# EAGLE board Analog CAN Module (EAGLE 8.3.2), part 1 of 2
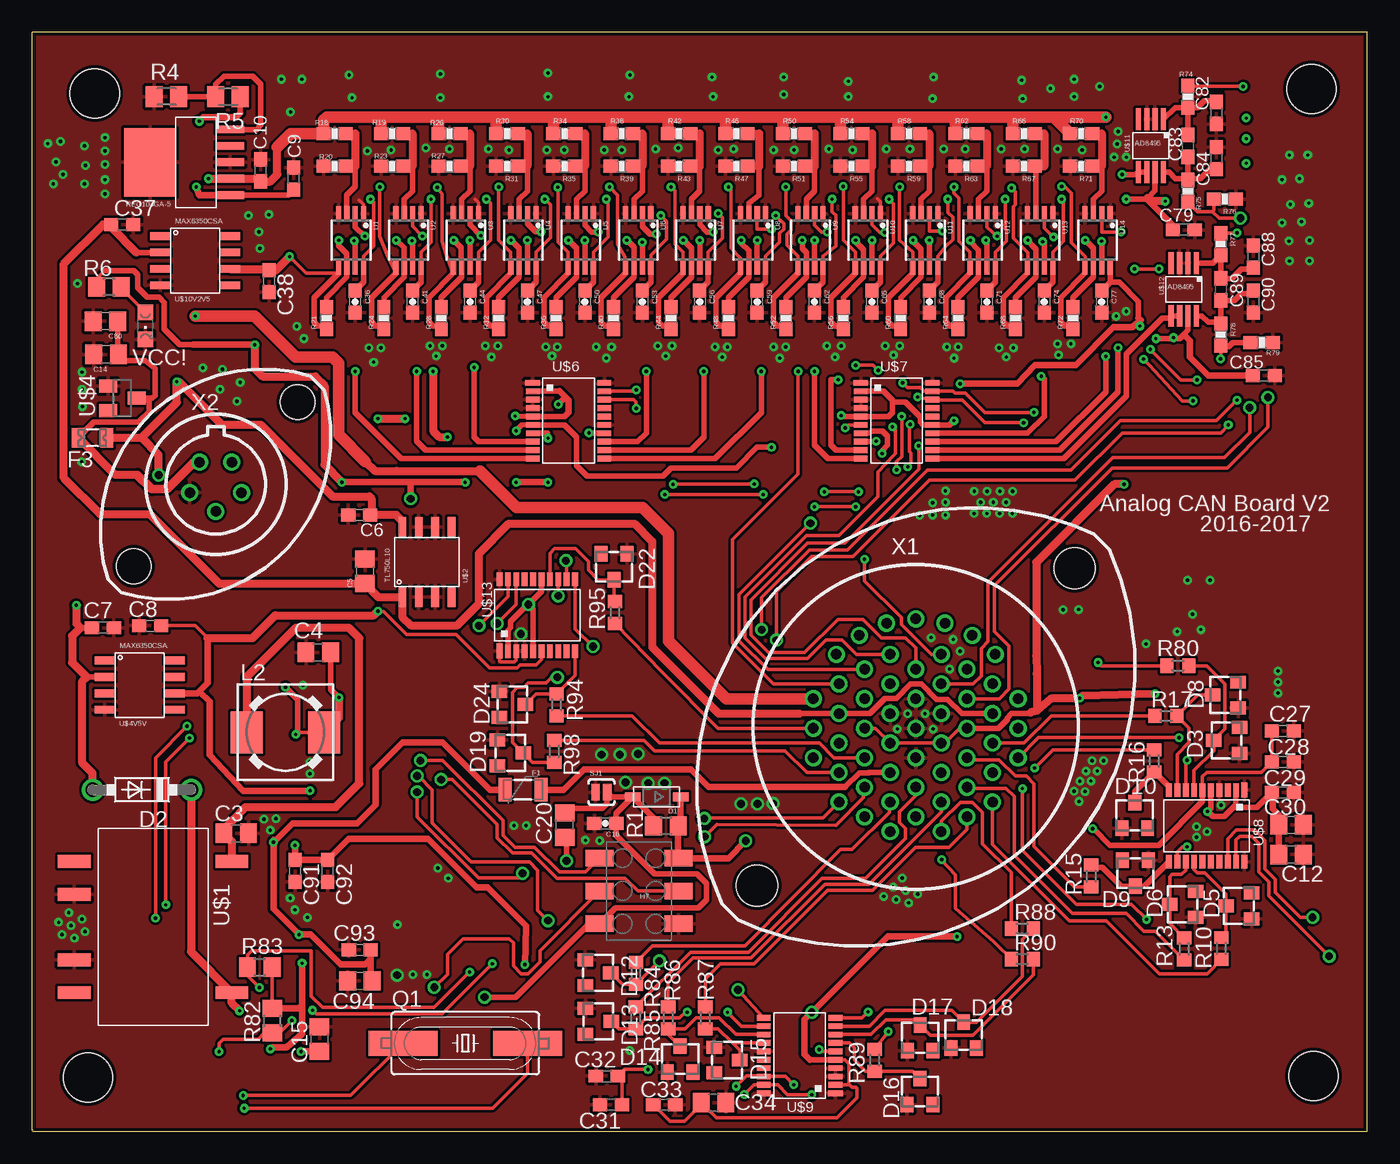
[diagram p3: board, top side]
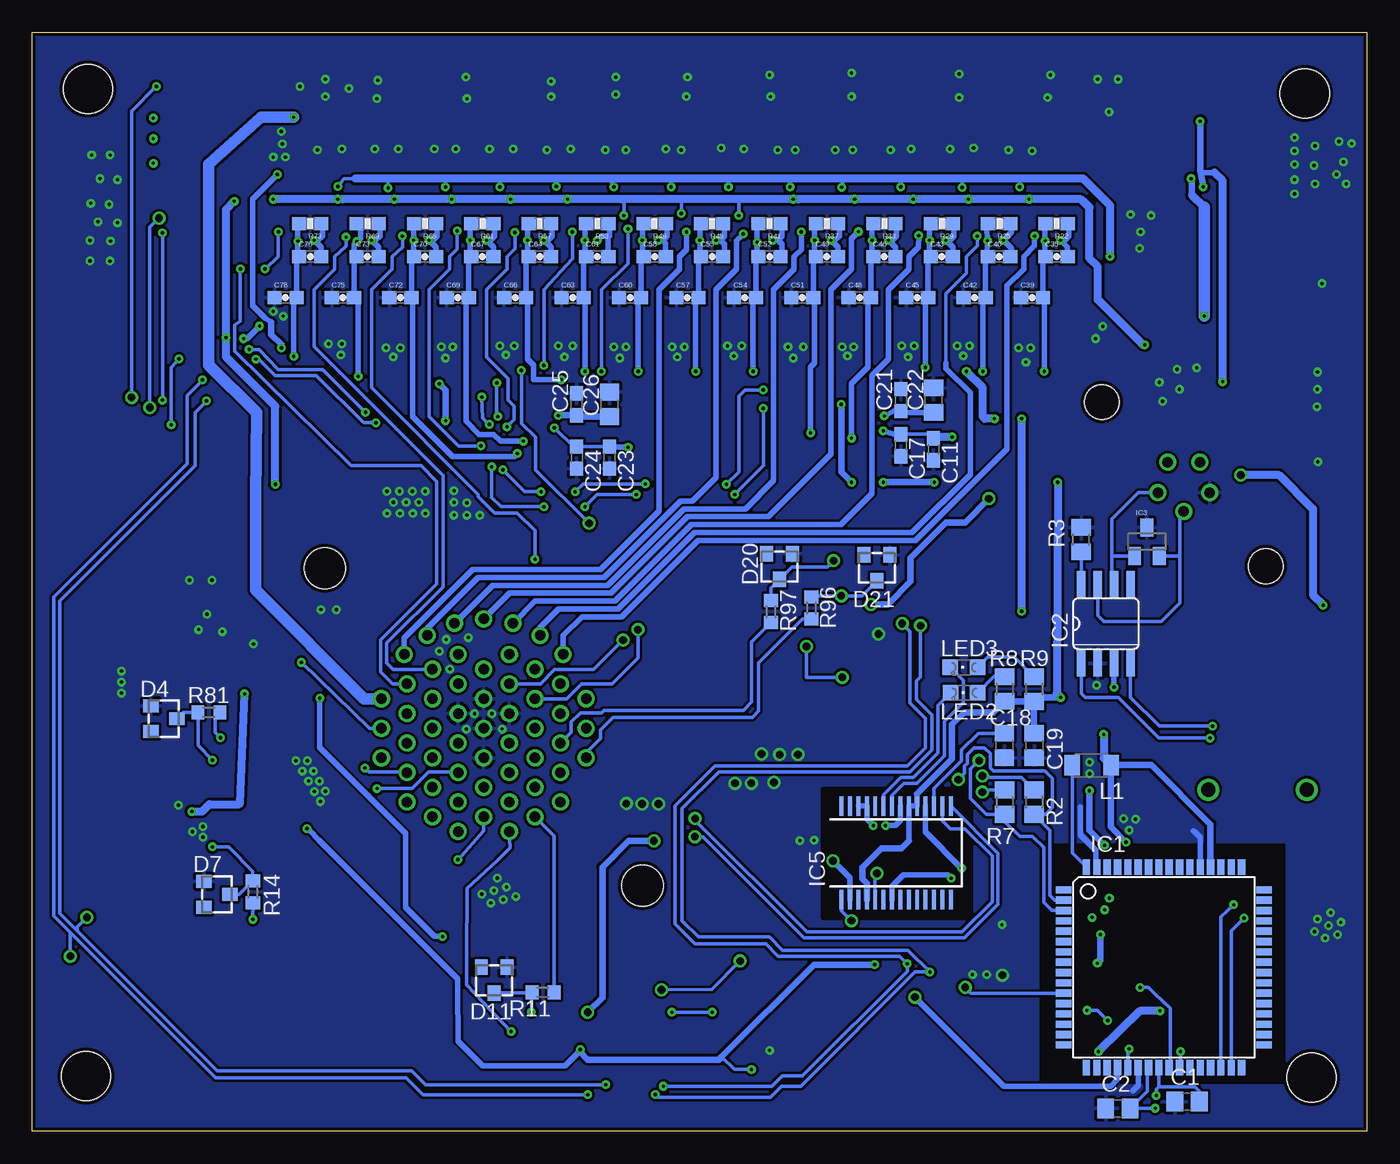
[diagram p4: board, bottom side, seen from below]

Size 103.33 x 85.08 mm. Coordinates in mm from the lower left corner, seen from the top.
Outline: 0,0 103.33,0 103.33,85.08 0,85.08 0,0.08 0.08,0.08
Copper layers (1*16): Top 0.035mm / dielectric 1.5mm / Bottom 0.035mm
Design rules "default *": minimum track width 8mil, minimum drill 10mil, track to track 8mil, track to pad 8mil, pad to pad 8mil, via to via 8mil, smd to smd 8mil, copper to edge 11mil, drill to drill 11mil, minimum pad ring 10mil, minimum via ring 8mil, stop-mask expansion 4mil, vias tented up to drill 0mil, thermal gap 10mil
Holes 3.81 mm at 99.02,80.69 4.83,80.34 4.3,4.15 99.18,4.27

## Footprints (pad centres in the part's own frame; a part is rotated, then mirrored left to right if it is on the bottom)
C0805@1 = smd 1.3 x 1.5: 1 -0.95,0; 2 0.95,0
C0805 = smd 1.3 x 1.5: 1 -0.95,0; 2 0.95,0
C0603 = smd 1.1 x 1: 1 -0.85,0; 2 0.85,0
C0603@1 = smd 1.1 x 1: 1 -0.85,0; 2 0.85,0
0603-CAP = smd 1.1 x 1: 1 -0.85,0; 2 0.85,0
SOD-123 = smd 1.2 x 0.7: A 1.85,0; C -1.85,0
DO41-7.6 = drill 1.1 pad 1.7: A 3.81,0; C -3.81,0
TO236 = smd 1 x 1.2: A -1,-1; C 0,1; NC 1,-1
PTC-1206 = smd 1 x 1.8: 1 -1.4,0; 2 1.4,0
0805L = smd 1 x 1.5: 1 -1.1,0; 2 1.1,0
2X3_SMD_FCI_54202-G30 = smd 1.27 x 2.18: 1 -2.54,-3.05; 2 -2.54,3.05; 3 0,-3.05; 4 0,3.05; 5 2.54,-3.05; 6 2.54,3.05
TQFP64 = smd 1.194 x 0.559: 1 -7.76,6; 2 -7.76,5.2; 3 -7.76,4.4; 4 -7.76,3.6; 5 -7.76,2.8; 6 -7.76,2; 7 -7.76,1.2; 8 -7.76,0.4; 9 -7.76,-0.4; 10 -7.76,-1.2; 11 -7.76,-2; 12 -7.76,-2.8; 13 -7.76,-3.6; 14 -7.76,-4.4; 15 -7.76,-5.2; 16 -7.76,-6; 33 7.76,-6; 34 7.76,-5.2; 35 7.76,-4.4; 36 7.76,-3.6; 37 7.76,-2.8; 38 7.76,-2; 39 7.76,-1.2; 40 7.76,-0.4; 41 7.76,0.4; 42 7.76,1.2; 43 7.76,2; 44 7.76,2.8; 45 7.76,3.6; 46 7.76,4.4; 47 7.76,5.2; 48 7.76,6 | smd 0.559 x 1.194: 17 -6,-7.76; 18 -5.2,-7.76; 19 -4.4,-7.76; 20 -3.6,-7.76; 21 -2.8,-7.76; 22 -2,-7.76; 23 -1.2,-7.76; 24 -0.4,-7.76; 25 0.4,-7.76; 26 1.2,-7.76; 27 2,-7.76; 28 2.8,-7.76; 29 3.6,-7.76; 30 4.4,-7.76; 31 5.2,-7.76; 32 6,-7.76; 49 6,7.76; 50 5.2,7.76; 51 4.4,7.76; 52 3.6,7.76; 53 2.8,7.76; 54 2,7.76; 55 1.2,7.76; 56 0.4,7.76; 57 -0.4,7.76; 58 -1.2,7.76; 59 -2,7.76; 60 -2.8,7.76; 61 -3.6,7.76; 62 -4.4,7.76; 63 -5.2,7.76; 64 -6,7.76
SO08 = smd 0.66 x 2.032: 1 -1.905,-3.073; 2 -0.635,-3.073; 3 0.635,-3.073; 4 1.905,-3.073; 5 1.905,3.073; 6 0.635,3.073; 7 -0.635,3.073; 8 -1.905,3.073
SOT-23 = smd 1 x 1.4: 1 -0.95,-1.1; 2 0.95,-1.1; 3 0,1.1
SSOP28 = smd 0.381 x 1.499: 1 -4.225,-3.625; 2 -3.575,-3.625; 3 -2.925,-3.625; 4 -2.275,-3.625; 5 -1.625,-3.625; 6 -0.975,-3.625; 7 -0.325,-3.625; 8 0.325,-3.625; 9 0.975,-3.625; 10 1.625,-3.625; 11 2.275,-3.625; 12 2.925,-3.625; 13 3.575,-3.625; 14 4.225,-3.625; 15 4.225,3.625; 16 3.575,3.625; 17 2.925,3.625; 18 2.275,3.625; 19 1.625,3.625; 20 0.975,3.625; 21 0.325,3.625; 22 -0.325,3.625; 23 -0.975,3.625; 24 -1.625,3.625; 25 -2.275,3.625; 26 -2.925,3.625; 27 -3.575,3.625; 28 -4.225,3.625
L3216C = smd 1.2 x 1.6: 1 -1.5,0; 2 1.5,0
DR73 = smd 2.5 x 3.25: 1 -3,0; 2 3,0
CHIPLED_0805 = smd 1.2 x 1.2: A 0,-1.05; C 0,1.05
HC49UP = smd 5.334 x 1.93: 1 -4.826,0; 2 4.826,0
R0805 = smd 1.3 x 1.5: 1 -0.95,0; 2 0.95,0
M0805 = smd 1.3 x 1.6: 1 -0.95,0; 2 0.95,0
R0603 = smd 1 x 1.1: 1 -0.85,0; 2 0.85,0
0603-RES = smd 1.1 x 1: 1 -0.85,0; 2 0.85,0
SJ_2S-NO = smd 0.635 x 1.27: 1 -0.45,0; 2 0.45,0
MSOP8 = smd 0.4 x 1.2: 1 -0.975,-2.05; 2 -0.325,-2.05; 3 0.325,-2.05; 4 0.975,-2.05; 5 0.975,2.05; 6 0.325,2.05; 7 -0.325,2.05; 8 -0.975,2.05
V78XX-1000 = smd 1 x 2.54: 1 -5.08,-6.096; 5 5.08,-6.096; 6 5.08,6.096; 7 2.54,6.096; 9 -2.54,6.096; 10 -5.08,6.096
8-SOIC = smd 0.6 x 1.55: P1 -1.905,-2.7; P2 -0.635,-2.7; P3 0.635,-2.7; P4 1.905,-2.7; P5 1.905,2.7; P6 0.635,2.7; P7 -0.635,2.7; P8 -1.905,2.7
SOT23-3 = smd 1 x 1.4: 1 -0.95,-1.1; 2 0.95,-1.1; 3 0,1.1
REG104GA-5 = smd 0.6 x 2.2: ENABLE 2.54,-6.2; GND 0,-6.2; NR/ADJUST 1.27,-6.2; VIN -2.54,-6.2; VOUT -1.27,-6.2 | smd 5.3 x 4: HEATGND 0,0
20TSSOP = smd 0.45 x 1.15: 1 -2.925,-2.775 | smd 0.45 x 1.05: 2 -2.275,-2.775; 3 -1.625,-2.775; 4 -0.975,-2.775; 5 -0.325,-2.775; 6 0.325,-2.775; 7 0.975,-2.775; 8 1.625,-2.775; 9 2.275,-2.775; 10 2.925,-2.775; 11 2.925,2.775; 12 2.275,2.775; 13 1.625,2.775; 14 0.975,2.775; 15 0.325,2.775; 16 -0.325,2.775; 17 -0.975,2.775; 18 -1.625,2.775; 19 -2.275,2.775; 20 -2.925,2.775
8MSOP = smd 0.4 x 1.7: P1 -0.975,-2.05; P2 -0.325,-2.05; P3 0.325,-2.05; P4 0.975,-2.05; P5 0.975,2.05; P6 0.325,2.05; P7 -0.325,2.05; P8 -0.975,2.05
AS16-35 = drill 0.813: 1 -7.925,2.184; 2 -7.925,-0.102; 3 -7.925,-2.388; 4 -6.147,5.613; 5 -5.944,3.327; 6 -5.944,1.041; 7 -5.944,-1.245; 8 -5.944,-3.531; 9 -5.944,-5.817; 10 -4.369,7.087; 11 -3.962,4.47; 12 -3.962,2.184; 13 -3.962,-0.102; 14 -3.962,-2.388; 15 -3.962,-4.674; 16 -3.962,-6.96; 17 -2.261,8.026; 18 -1.981,5.613; 19 -1.981,3.327; 20 -1.981,1.041; 21 -1.981,-1.245; 22 -1.981,-3.531; 23 -1.981,-5.817; 24 -1.981,-8.103; 25 0,8.357; 26 0,4.47; 27 0,2.184; 28 0,-0.102; 29 0,-2.388; 30 0,-4.674; 31 0,-6.96; 32 2.261,8.026; 33 1.981,5.613; 34 1.981,3.327; 35 1.981,1.041; 36 1.981,-1.245; 37 1.981,-3.531; 38 1.981,-5.817; 39 1.981,-8.103; 40 4.369,7.087; 41 3.962,4.47; 42 3.962,2.184; 43 3.962,-0.102; 44 3.962,-2.388; 45 3.962,-4.674; 46 3.962,-6.96; 47 6.147,5.613; 48 5.944,3.327; 49 5.944,1.041; 50 5.944,-1.245; 51 5.944,-3.531; 52 5.944,-5.817; 53 7.925,2.184; 54 7.925,-0.102; 55 7.925,-2.388 | hole 3.2: 12.29,12.29; -12.29,-12.29
AS06-05 = drill 0.813: 1 -1.245,1.702; 2 -2.007,-0.66; 3 0,-2.108; 4 2.007,-0.66; 5 1.245,1.702 | hole 2.7: -6.35,-6.35; 6.35,6.35

## Placement (x,y rotation side)
C1  18pF  [C0805@1]  13.94,2.3 0 bottom
C2  18pF  [C0805@1]  19.3,1.77 0 bottom
C3  22uF  [C0805]  15.79,23.08 0 top
C4  22uF  [C0805]  22.14,37.08 180 top
C5  10uF  [C0805]  25.75,43.35 90 top
C6  0.1uF  [C0603]  25.31,47.71 180 top
C7  2.2uF  [C0603@1]  5.47,38.98 0 top
C8  2.2uF  [C0603@1]  9.12,39.14 180 top
C9  0.1uF  [C0603]  20.23,73.75 90 top
C10  0.1uF  [C0603]  17.69,74.38 90 top
C11  1uF  [C0603@1]  33.57,52.79 270 bottom
C12  100n  [C0805@1]  97.45,21.43 0 top
C14  22uF  [C0805]  5.71,60.15 180 top
C15  10uF  [C0805]  22.24,7.14 90 top
C16  4.7nF  [0603-CAP]  44.35,23.84 180 top
C17  0.1uF  [C0603@1]  36.11,53.11 270 bottom
C18  100n  [C0805@1]  28.09,29.87 270 bottom
C19  100n  [C0805@1]  25.77,29.87 270 bottom
C20  100n  [C0805@1]  41.21,23.71 90 top
C21  0.1uF  [C0603@1]  36.11,56.6 90 bottom
C22  10uF  [C0805@1]  33.57,56.6 90 bottom
C23  1uF  [C0603@1]  58.65,52.16 270 bottom
C24  0.1uF  [C0603@1]  61.19,52.16 270 bottom
C25  0.1uF  [C0603@1]  61.19,56.29 90 bottom
C26  10uF  [C0805@1]  58.65,56.29 90 bottom
C27  1uF  [C0603@1]  96.81,30.99 0 top
C28  0.1uF  [C0603@1]  96.81,28.61 0 top
C29  0.1uF  [C0603@1]  96.81,26.23 0 top
C30  10uF  [C0805@1]  97.44,23.73 0 top
C31  1uF  [C0603@1]  44.79,2.06 180 top
C32  0.1uF  [C0603@1]  44.48,4.28 180 top
C33  0.1uF  [C0603@1]  48.92,2.06 0 top
C34  10uF  [C0805@1]  52.73,2.22 0 top
C35  .1uF  [0603-CAP]  24.04,67.72 0 bottom
C36  .1uF  [0603-CAP]  24.99,64.22 270 top
C37  2.2uF  [C0603@1]  6.96,70.19 0 top
C38  2.2uF  [C0603@1]  18.33,65.81 270 top
C39  .1uF  [0603-CAP]  25.95,64.54 0 bottom
C40  .1uF  [0603-CAP]  28.49,67.72 0 bottom
C41  .1uF  [0603-CAP]  29.44,64.22 270 top
C42  .1uF  [0603-CAP]  30.39,64.54 0 bottom
C43  .1uF  [0603-CAP]  32.93,67.72 0 bottom
C44  .1uF  [0603-CAP]  33.88,64.22 270 top
C45  .1uF  [0603-CAP]  34.84,64.54 0 bottom
C46  .1uF  [0603-CAP]  37.38,67.72 0 bottom
C47  .1uF  [0603-CAP]  38.33,64.22 270 top
C48  .1uF  [0603-CAP]  39.28,64.54 0 bottom
C49  .1uF  [0603-CAP]  41.82,67.72 0 bottom
C50  .1uF  [0603-CAP]  42.77,64.22 270 top
C51  .1uF  [0603-CAP]  43.73,64.54 0 bottom
C52  .1uF  [0603-CAP]  46.27,67.72 0 bottom
C53  .1uF  [0603-CAP]  47.22,64.22 270 top
C54  .1uF  [0603-CAP]  48.17,64.54 0 bottom
C55  .1uF  [0603-CAP]  50.71,67.72 0 bottom
C56  .1uF  [0603-CAP]  51.66,64.22 270 top
C57  .1uF  [0603-CAP]  52.62,64.54 0 bottom
C58  .1uF  [0603-CAP]  55.16,67.72 0 bottom
C59  .1uF  [0603-CAP]  56.11,64.22 270 top
C60  .1uF  [0603-CAP]  57.06,64.54 0 bottom
C61  .1uF  [0603-CAP]  59.6,67.72 0 bottom
C62  .1uF  [0603-CAP]  60.55,64.22 270 top
C63  .1uF  [0603-CAP]  61.51,64.54 0 bottom
C64  .1uF  [0603-CAP]  64.05,67.72 0 bottom
C65  .1uF  [0603-CAP]  65,64.22 270 top
C66  .1uF  [0603-CAP]  65.95,64.54 0 bottom
C67  .1uF  [0603-CAP]  68.49,67.72 0 bottom
C68  .1uF  [0603-CAP]  69.44,64.22 270 top
C69  .1uF  [0603-CAP]  70.4,64.54 0 bottom
C70  .1uF  [0603-CAP]  72.94,67.72 0 bottom
C71  .1uF  [0603-CAP]  73.89,64.22 270 top
C72  .1uF  [0603-CAP]  74.84,64.54 0 bottom
C73  .1uF  [0603-CAP]  77.38,67.72 0 bottom
C74  .1uF  [0603-CAP]  78.33,64.22 270 top
C75  .1uF  [0603-CAP]  79.29,64.54 0 bottom
C76  .1uF  [0603-CAP]  81.83,67.72 0 bottom
C77  .1uF  [0603-CAP]  82.78,64.22 270 top
C78  .1uF  [0603-CAP]  83.73,64.54 0 bottom
C79  0.1uF  [C0603]  89.13,69.78 0 top
C80  22uF  [C0805]  5.66,62.71 180 top
C82  1nF  [C0603]  91.67,78.83 90 top
C83  10nF  [C0603]  89.45,76.29 270 top
C84  1nF  [C0603]  91.67,75.34 90 top
C85  0.1uF  [C0603]  95.32,58.51 0 top
C88  1nF  [C0603]  94.53,67.72 270 top
C89  10nF  [C0603]  91.99,65.18 270 top
C90  1nF  [C0603]  94.53,64.22 270 top
C91  1uF  [C0603@1]  20.33,20.15 270 top
C92  0.1uF  [C0603@1]  22.87,20.15 270 top
C93  0.1uF  [C0603@1]  25.35,14.05 180 top
C94  10uF  [C0805@1]  25.36,11.65 180 top
D1  1N4148  [SOD-123]  48.33,25.9 180 top
D2  1N5819  [DO41-7.6]  8.48,26.44 180 top
D3  BZX84CSMD  [TO236]  92.44,30.26 90 top
D4  BZX84CSMD  [TO236]  93.15,31.94 270 bottom
D5  BZX84CSMD  [TO236]  93.4,17.46 90 top
D6  BZX84CSMD  [TO236]  89.04,17.56 90 top
D7  BZX84CSMD  [TO236]  89.04,18.34 270 bottom
D8  BZX84CSMD  [TO236]  92.35,33.77 90 top
D9  BZX84CSMD  [TO236]  85.38,19.98 180 top
D10  BZX84CSMD  [TO236]  85.33,24.46 0 top
D11  BZX84CSMD  [TO236]  67.58,11.7 180 bottom
D12  BZX84CSMD  [TO236]  43.79,12.28 270 top
D13  BZX84CSMD  [TO236]  43.81,8.51 270 top
D14  BZX84CSMD  [TO236]  50.15,5.59 0 top
D15  BZX84CSMD  [TO236]  53.77,5.52 270 top
D16  BZX84CSMD  [TO236]  68.72,3.07 0 top
D17  BZX84CSMD  [TO236]  68.73,7.24 0 top
D18  BZX84CSMD  [TO236]  72.1,7.45 0 top
D19  BZX84CSMD  [TO236]  37.01,29.3 270 top
D20  BZX84CSMD  [TO236]  45.5,43.72 180 bottom
D21  BZX84CSMD  [TO236]  37.94,43.62 180 bottom
D22  BZX84CSMD  [TO236]  45.02,43.69 180 top
D24  BZX84CSMD  [TO236]  37.17,33.04 270 top
F1  16V,0.25A  [PTC-1206]  37.99,26.45 0 top
F3  0805L050  [0805L]  4.66,53.69 179.9 top
H7  ICSP  [2X3_SMD_FCI_54202-G30]  46.97,18.61 270 top
IC1  AT90CAN128  [TQFP64]  15.73,12.69 0 bottom
IC2  MCP2551SO8  [SO08]  20.23,39.3 0 bottom
IC3  NUP2105L  [SOT-23]  17.06,45.65 0 bottom
IC5  FT232RL  [SSOP28]  36.46,21.55 0 bottom
L1  CS321613-100K  [L3216C]  21.34,28.35 180 bottom
L2  22uH  [DR73]  19.6,30.89 0 top
LED2  RX  [CHIPLED_0805]  31.19,33.95 90 bottom
LED3  TX  [CHIPLED_0805]  31.22,35.92 90 bottom
Q1  56P2859  [HC49UP]  33.52,6.82 0 top
R1  100K  [R0805]  49.05,23.65 0 top
R2  1k  [R0805]  25.79,25.48 270 bottom
R3  100K  [R0805]  22.14,45.81 90 bottom
R4  100K  [M0805]  10.39,80.1 0 top
R5  100K  [M0805]  15.15,80.1 180 top
R6  1K  [R0805]  5.94,65.37 180 top
R7  1k  [R0805]  28.07,25.48 270 bottom
R8  1k  [R0805]  28.07,34.25 270 bottom
R9  1k  [R0805]  25.79,34.24 270 bottom
R10  180  [R0603]  92.05,14.15 90 top
R11  [R0603]  63.8,10.77 180 bottom
R13  180  [R0603]  89.15,14.12 90 top
R14  180  [R0603]  86.26,18.54 90 bottom
R15  180  [R0603]  81.97,19.76 90 top
R16  180  [R0603]  86.84,28.68 270 top
R17  180  [R0603]  87.76,32.16 0 top
R18  1k  [0603-RES]  23.41,77.24 0 top
R19  1k  [0603-RES]  27.85,77.24 0 top
R20  1k  [0603-RES]  23.41,74.7 180 top
R21  10  [0603-RES]  22.77,62.95 90 top
R22  100R680R3k3  [0603-RES]  24.04,70.26 180 bottom
R23  1k  [0603-RES]  27.85,74.7 180 top
R24  10  [0603-RES]  27.22,62.95 90 top
R25  100R680R3k3  [0603-RES]  28.49,70.26 180 bottom
R26  1k  [0603-RES]  32.3,77.24 0 top
R27  1k  [0603-RES]  32.3,74.7 180 top
R28  10  [0603-RES]  31.66,62.95 90 top
R29  100R680R3k3  [0603-RES]  32.93,70.26 180 bottom
R30  1k  [0603-RES]  36.74,77.24 0 top
R31  1k  [0603-RES]  36.74,74.7 180 top
R32  10  [0603-RES]  36.11,62.95 90 top
R33  100R680R3k3  [0603-RES]  37.38,70.26 180 bottom
R34  1k  [0603-RES]  41.19,77.24 0 top
R35  1k  [0603-RES]  41.19,74.7 180 top
R36  10  [0603-RES]  40.55,62.95 90 top
R37  100R680R3k3  [0603-RES]  41.82,70.26 180 bottom
R38  1k  [0603-RES]  45.63,77.24 0 top
R39  1k  [0603-RES]  45.63,74.7 180 top
R40  10  [0603-RES]  45,62.95 90 top
R41  100R680R3k3  [0603-RES]  46.27,70.26 180 bottom
R42  1k  [0603-RES]  50.08,77.24 0 top
R43  1k  [0603-RES]  50.08,74.7 180 top
R44  10  [0603-RES]  49.44,62.95 90 top
R45  100R680R3k3  [0603-RES]  50.71,70.26 180 bottom
R46  1k  [0603-RES]  54.52,77.24 0 top
R47  1k  [0603-RES]  54.52,74.7 180 top
R48  10  [0603-RES]  53.89,62.95 90 top
R49  100R680R3k3  [0603-RES]  55.16,70.26 180 bottom
R50  1k  [0603-RES]  58.97,77.24 0 top
R51  1k  [0603-RES]  58.97,74.7 180 top
R52  10  [0603-RES]  58.33,62.95 90 top
R53  100R680R3k3  [0603-RES]  59.6,70.26 180 bottom
R54  1k  [0603-RES]  63.41,77.24 0 top
R55  1k  [0603-RES]  63.41,74.7 180 top
R56  10  [0603-RES]  62.78,62.95 90 top
R57  100R680R3k3  [0603-RES]  64.05,70.26 180 bottom
R58  1k  [0603-RES]  67.86,77.24 0 top
R59  1k  [0603-RES]  67.86,74.7 180 top
R60  10  [0603-RES]  67.22,62.95 90 top
R61  100R680R3k3  [0603-RES]  68.49,70.26 180 bottom
R62  1k  [0603-RES]  72.3,77.24 0 top
R63  1k  [0603-RES]  72.3,74.7 180 top
R64  10  [0603-RES]  71.67,62.95 90 top
R65  100R680R3k3  [0603-RES]  72.94,70.26 180 bottom
R66  1k  [0603-RES]  76.75,77.24 0 top
R67  1k  [0603-RES]  76.75,74.7 180 top
R68  10  [0603-RES]  76.11,62.95 90 top
R69  100R680R3k3  [0603-RES]  77.38,70.26 180 bottom
R70  1k  [0603-RES]  81.19,77.24 0 top
R71  1k  [0603-RES]  81.19,74.7 180 top
R72  10  [0603-RES]  80.56,62.95 90 top
R73  100R680R3k3  [0603-RES]  81.83,70.26 180 bottom
R74  10K  [0603-RES]  89.45,80.1 270 top
R75  10K  [0603-RES]  89.45,72.8 270 top
R76  1M  [0603-RES]  92.3,72.16 180 top
R77  10K  [0603-RES]  91.99,68.67 270 top
R78  10K  [0603-RES]  91.99,61.68 270 top
R79  1M  [0603-RES]  95.16,61.05 180 top
R80  180  [R0603]  88.67,36.04 0 top
R81  180  [R0603]  89.66,32.44 180 bottom
R82  4.7k  [R0805]  18.59,8.57 90 top
R83  4.7k  [R0805]  17.61,12.72 0 top
R84  [R0603]  46.74,12.22 270 top
R85  [R0603]  46.71,8.79 270 top
R86  [R0603]  49.23,8.79 270 top
R87  [R0603]  52.1,8.79 270 top
R88  [R0603]  76.63,15.7 0 top
R89  [R0603]  65.2,5.51 270 top
R90  [R0603]  76.63,13.34 0 top
R94  [R0603]  40.59,33.02 90 top
R95  [R0603]  45.11,40.16 90 top
R96  [R0603]  43.03,40.51 90 bottom
R97  [R0603]  46.15,40.23 90 bottom
R98  [R0603]  40.41,29.41 270 top
SJ1  SOLDERJUMPERNO  [SJ_2S-NO]  44.06,26.25 0 top
U1  LTC2053  [MSOP8]  24.68,68.99 180 top
U2  LTC2053  [MSOP8]  29.12,68.99 180 top
U3  LTC2053  [MSOP8]  33.57,68.99 180 top
U4  LTC2053  [MSOP8]  38.01,68.99 180 top
U5  LTC2053  [MSOP8]  42.46,68.99 180 top
U6  LTC2053  [MSOP8]  46.9,68.99 180 top
U7  LTC2053  [MSOP8]  51.35,68.99 180 top
U8  LTC2053  [MSOP8]  55.79,68.99 180 top
U9  LTC2053  [MSOP8]  60.24,68.99 180 top
U10  LTC2053  [MSOP8]  64.68,68.99 180 top
U11  LTC2053  [MSOP8]  69.13,68.99 180 top
U12  LTC2053  [MSOP8]  73.57,68.99 180 top
U13  LTC2053  [MSOP8]  78.02,68.99 180 top
U14  LTC2053  [MSOP8]  82.46,68.99 180 top
U$1  V7805-1000  [V78XX-1000]  9.35,15.82 90 top
U$2  TL750L10  [8-SOIC]  30.55,44.06 0 top
U$4  MMBD4448H-7-F  [SOT23-3]  6.97,56.75 270 top
U$4V5V  MAX6350CSA  [8-SOIC]  8.32,34.54 270 top
U$5  REG-104GA-5  [REG104GA-5]  9.12,75.02 90 top
U$6  AD7998  [20TSSOP]  41.5,55.02 270 top
U$7  AD7998  [20TSSOP]  66.9,55.02 270 top
U$8  AD7998  [20TSSOP]  90.91,23.65 180 top
U$9  AD7998  [20TSSOP]  59.4,5.87 90 top
U$10V2V5  MAX6350CSA  [8-SOIC]  12.61,67.4 270 top
U$11  AD8495  [8MSOP]  86.59,76.29 180 top
U$12  AD8495  [8MSOP]  89.13,65.18 180 top
U$13  AD7998  [20TSSOP]  39.09,39.95 0 top
VCC!  PWR  [CHIPLED_0805]  8.75,62.35 180 top
X1  AS16-35  [AS16-35]  68.39,31.31 0 top
X2  AS06-05  [AS06-05]  14.2,50.1 0 top